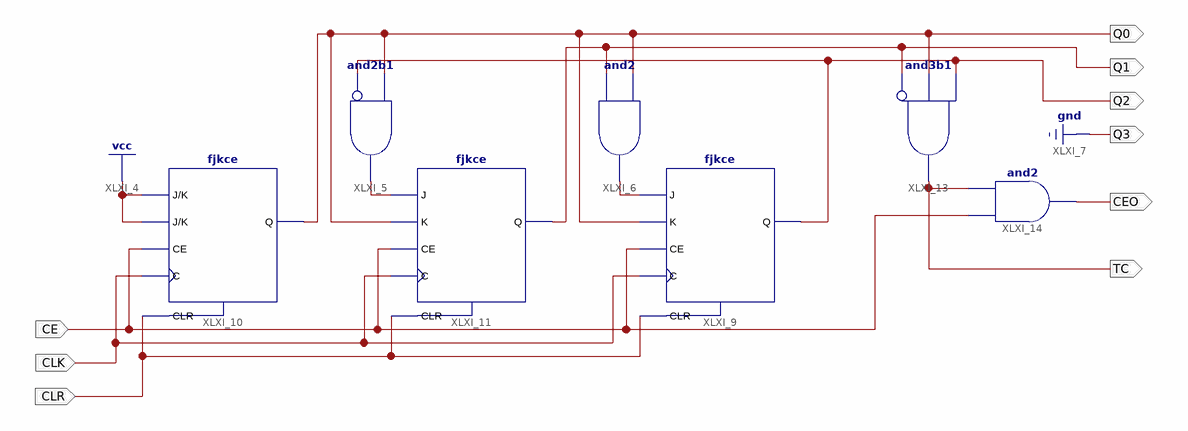
[diagram p0: schematic sheet 1]
// Xilinx ISE schematic C64CE.sch (spartan6) as structural Verilog: 7 symbols, 9 ports
module C64CE (
  input  CLR,
  input  CE,
  input  CLK,
  output CEO,
  output TC,
  output Q1,
  output Q2,
  output Q3,
  output Q0
);

  wire XLXN_6, XLXN_10;

  and XLXI_14 (CEO, CE, TC);
  and XLXI_13 (TC, ~Q1, Q0, Q2);  // and3b1
  fjkce XLXI_9 (.C(CLK), .CE(CE), .CLR(CLR), .J(XLXN_10), .K(Q0), .Q(Q2));
  fjkce XLXI_11 (.C(CLK), .CE(CE), .CLR(CLR), .J(XLXN_6), .K(Q0), .Q(Q1));
  fjkce XLXI_10 (.C(CLK), .CE(CE), .CLR(CLR), .J(1'b1), .K(1'b1), .Q(Q0));
  and XLXI_6 (XLXN_10, Q1, Q0);
  and XLXI_5 (XLXN_6, ~Q2, Q0);  // and2b1

  assign Q3 = 1'b0;
endmodule
